# EAGLE design board-v2 (EAGLE 9.1.3)
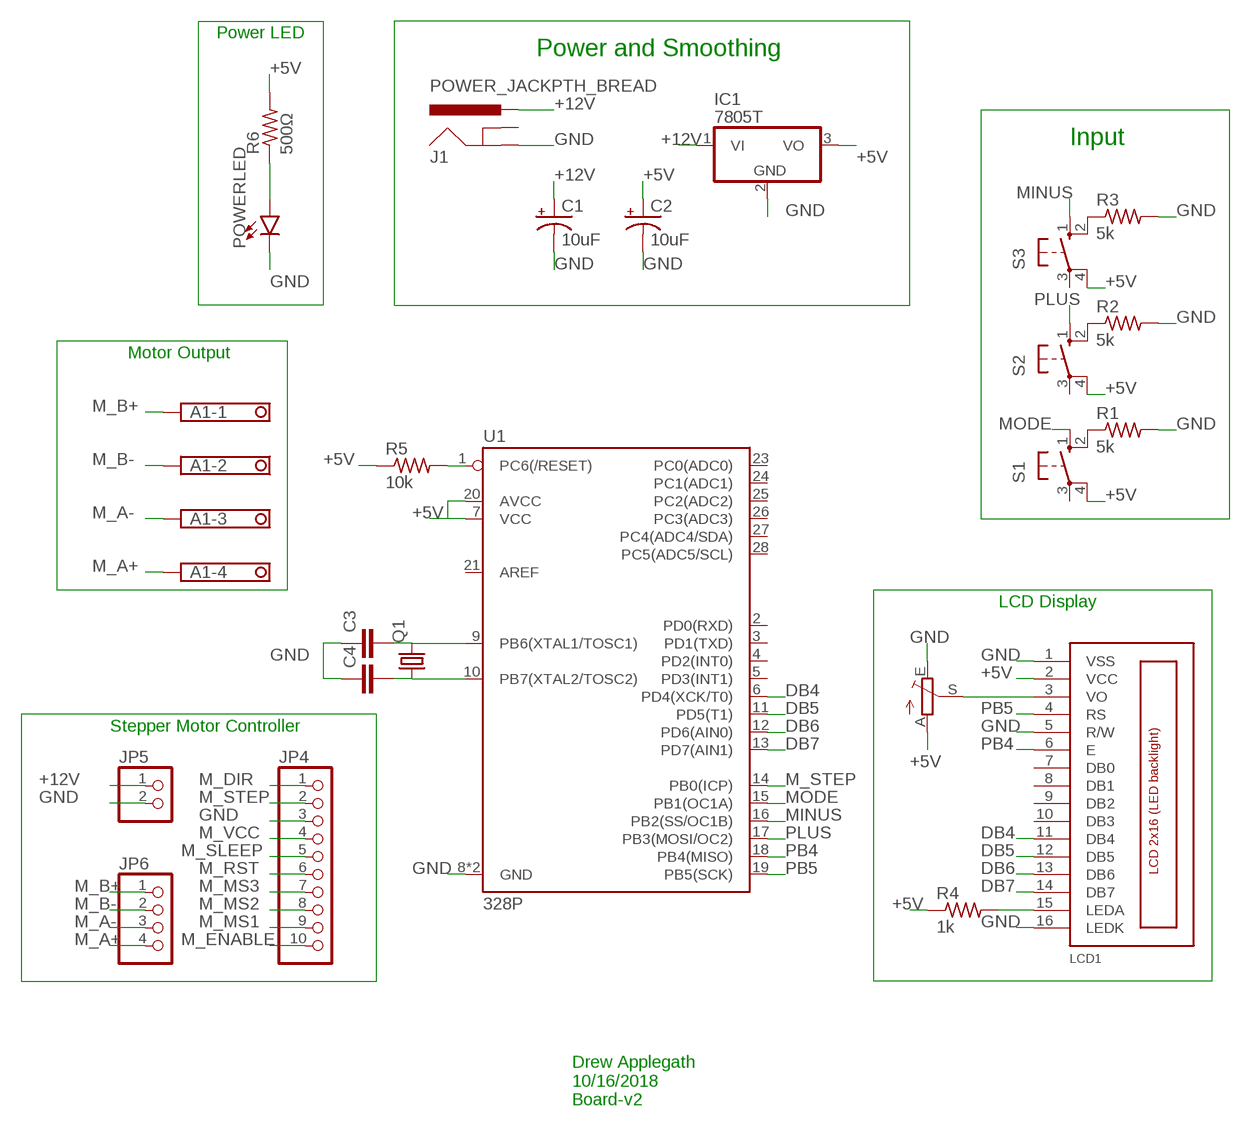
[diagram p0: schematic, sheet 1]

## Parts
A1  TERMINAL-BLOCK-3.5MM-4-PIN-LONG-PAD  [TERMINAL-BLOCK-4-PIN-3.5MM-LONG-PAD]
C1  10uF  10UF-POLAR-RADIAL-2.5MM-25V-20%  [CPOL-RADIAL-2.5MM-5MM]
C2  10uF  10UF-POLAR-RADIAL-2.5MM-25V-20%  [CPOL-RADIAL-2.5MM-5MM]
C3  C-EU025-024X044  [C025-024X044]
C4  C-EU025-024X044  [C025-024X044]
IC1  7805T  [TO220H]
J1  POWER_JACKPTH_BREAD  [POWER_JACK_PTH_BREAD]
JP4  PINHD-1X10  [1X10]
JP5  PINHD-1X2  [1X02]
JP6  PINHD-1X4  [1X04]
LCD1  LCD_2X16_SIL  [HY-1602F]
POWERLED  LED-3MM-NO_SILK  [LED_3MM-NS]
Q1  CRYSTALHC49S  [HC49/S]
R1  5k  R-US_0207/7  [0207/7]
R2  5k  R-US_0207/7  [0207/7]
R3  5k  R-US_0207/7  [0207/7]
R4  1k  R-US_0207/7  [0207/7]
R5  10k  R-US_0207/7  [0207/7]
R6  500Ω  R-US_0207/7  [0207/7]
R7  TRIM_EU-S63S  [S63S]
S1  40-XX  [B3F-40XX]
S2  40-XX  [B3F-40XX]
S3  40-XX  [B3F-40XX]
U1  328P  ATMEGA328P_PDIP  [DIP28]

## Nets
+5V: C2.1(+) IC1.3(VO) LCD1.2(VCC) R4.1 R5.1 R6.2 R7.A S1.4(P1) S2.4(P1) S3.4(P1) U1.7(VCC) U1.20(AVCC)
+12V: C1.1(+) IC1.1(VI) J1.PWR JP5.1
DB4: LCD1.11(DB4) U1.6(PD4(XCK/T0))
DB5: LCD1.12(DB5) U1.11(PD5(T1))
DB6: LCD1.13(DB6) U1.12(PD6(AIN0))
DB7: LCD1.14(DB7) U1.13(PD7(AIN1))
GND: C1.2(-) C2.2(-) C3.1 C4.1 IC1.2(GND) J1.GND JP4.3 JP5.2 LCD1.1(VSS) LCD1.5(R/W) LCD1.16(LEDK) POWERLED.K(C) R1.2 R2.2 R3.2 R7.E U1.8(GND) U1.22(GND)
M_A+: A1.4 JP6.4
M_A-: A1.3 JP6.3
M_B+: A1.1 JP6.1
M_B-: A1.2 JP6.2
M_DIR: JP4.1
M_ENABLE: JP4.10
M_MS1: JP4.9
M_MS2: JP4.8
M_MS3: JP4.7
M_RST: JP4.6
M_SLEEP: JP4.5
M_STEP: JP4.2 U1.14(PB0(ICP))
M_VCC: JP4.4
MINUS: S3.1(S) U1.16(PB2(SS/OC1B))
MODE: S1.1(S) U1.15(PB1(OC1A))
N$1: C4.2 Q1.1 U1.10(PB7(XTAL2/TOSC2))
N$2: LCD1.3(VO) R7.S
N$4: R5.2 U1.1(PC6(/RESET))
N$8: LCD1.15(LEDA) R4.2
N$13: C3.2 Q1.2 U1.9(PB6(XTAL1/TOSC1))
N$14: R1.1 S1.2(S1)
N$15: R2.1 S2.2(S1)
N$16: R3.1 S3.2(S1)
N$18: POWERLED.A R6.1
PB4: LCD1.6(E) U1.18(PB4(MISO))
PB5: LCD1.4(RS) U1.19(PB5(SCK))
PLUS: S2.1(S) U1.17(PB3(MOSI/OC2))
Unconnected: J1.GNDBREAK LCD1.7(DB0) LCD1.8(DB1) LCD1.9(DB2) LCD1.10(DB3) S1.3(P) S2.3(P) S3.3(P) U1.2(PD0(RXD)) U1.3(PD1(TXD)) U1.4(PD2(INT0)) U1.5(PD3(INT1)) U1.21(AREF) U1.23(PC0(ADC0)) U1.24(PC1(ADC1)) U1.25(PC2(ADC2)) U1.26(PC3(ADC3)) U1.27(PC4(ADC4/SDA)) U1.28(PC5(ADC5/SCL))

## Notes on the sheet
- Power LED
- Power and Smoothing
- Input
- Motor Output
- LCD Display
- Stepper Motor Controller
- Drew Applegath
  10/16/2018
  Board-v2

## Library data of the parts
A1 = Rembrandt Electronics - Terminal Block 3-5mm v1-0:TERMINAL-BLOCK-3.5MM-4-PIN: Terminal Block 3.5mm Pitch: 3,5 mm Number of pins: 4 Created by Rembrandt Electronics www.rembrandtelectronics.com
C1 C2 = SparkFun-Capacitors:10UF-POLAR: 10.0µF polarized capacitors A capacitor is a passive two-terminal electrical component used to store electrical energy temporarily in an electric field.; PROD_ID: CAP-08440
C3 C4 = rcl:C-EU: CAPACITOR, European symbol; SPICEPREFIX: C
IC1 = linear:78*: Positive VOLTAGE REGULATOR Source: http://cache.national.com/ds/LM/LM78L05.pdf http://www.fairchildsemi.com/ds/LM/LM7805.pdf
J1 = SparkFun-Connectors:POWER_JACK: Power Jack Connector This is the standard 5.5mm barrel jack for power. The PTH is the most common, proven, reliable, footprint. The Slot footprint only works if the mill layer is transmitted to the PCB fab house so be warned. Here are the connectors we sell at SparkFun: DC Barrel Power Jack/Connector <https://www.sparkfun.com/products/119> (PRT-00119) DC Barrel Power Jack/Connector (SMD) <https://www.sparkfun.com/products/12748> (PRT-12748) DC Barrel Jack Adapter - Breadboard Compatible <https://www.sparkfun.com/products/10811> (PRT-10811) It is used on this SparkFun product (and many, many others): SparkFun RedBoard - Programmed with Arduino <https://www.sparkfun.com/products/12757> (DEV-12757) Also, if you need a mating power supply or connector, please check these out: Wall Adapter Power Supply - 9VDC 650mA <https://www.sparkfun.com/products/298> (TOL-00298) DC Barrel Jack Adapter - Male <https://www.sparkfun.com/products/10287> (PRT-10287); PROD_ID: PRT-10811
JP4 = pinhead:PINHD-1X10: PIN HEADER
JP5 = pinhead:PINHD-1X2: PIN HEADER
JP6 = pinhead:PINHD-1X4: PIN HEADER
LCD1 = lcd_2x16_led_backlight:LCD_2X16_SIL
POWERLED = SparkFun-LED:LED: LED (Generic) Standard schematic elements and footprints for 5mm, 3mm, 1206, and 0603 sized LEDs. Generic LEDs with no color specified.
Q1 = crystal:CRYSTAL: CRYSTAL; OC_FARNELL: 1667008; OC_NEWARK: unknown
R1-R6 = resistor:R-US_: RESISTOR, American symbol
R7 = pot:TRIM_EU-: POTENTIOMETER
S1-S3 = switch-omron:40-XX: OMRON SWITCH; MF: OMRON COMPONENTS USA; MPN: B3F-4000; OC_FARNELL: 176434; OC_NEWARK: 36K3105
U1 = SparkFun-IC-Microcontroller:ATMEGA328P_PDIP: Atmel 328P Through hole ATMEGA328P uC used in the Arduino 32kb flash, 1k EEPROM, 2k SRAM Datasheet <http://www.sparkfun.com/datasheets/Components/SMD/ATMega328.pdf> SparkFun Products Storefront component: AVR 28 Pin 20MHz 32K 6A/D - ATMega328P <https://www.sparkfun.com/products/9061> (COM-09061) SparkFun Simon Says - Through-Hole Soldering Kit <https://www.sparkfun.com/products/10547> (KIT-10547) SparkFun Learn to Solder - Simon Says <https://www.sparkfun.com/products/13708> (KIT-13708) SparkFun BigTime Watch Kit <https://www.sparkfun.com/products/11734> (KIT-11734) SparkFun ClockIt <https://www.sparkfun.com/products/10930> (KIT-10930) SparkFun Serial Enabled LCD Kit <https://www.sparkfun.com/products/10097> (LCD-10097) SparkFun Simon Tilts - Through Hole Soldering Kit <https://www.sparkfun.com/products/12634> (KIT-12634) SparkFun Frequency Counter Kit <https://www.sparkfun.com/products/10140> (KIT-10140) FabFM Radio Kit <https://www.sparkfun.com/products/11043> (KIT-11043) SparkFun Binary Blaster Kit <https://www.sparkfun.com/products/12037> (KIT-12037) SparkFun Metro-Gnome <https://www.sparkfun.com/products/9236> (KIT-09236) ATmega328 with Arduino Optiboot (Uno) <https://www.sparkfun.com/products/10524> (DEV-10524); PROD_ID: IC-09136

## Board
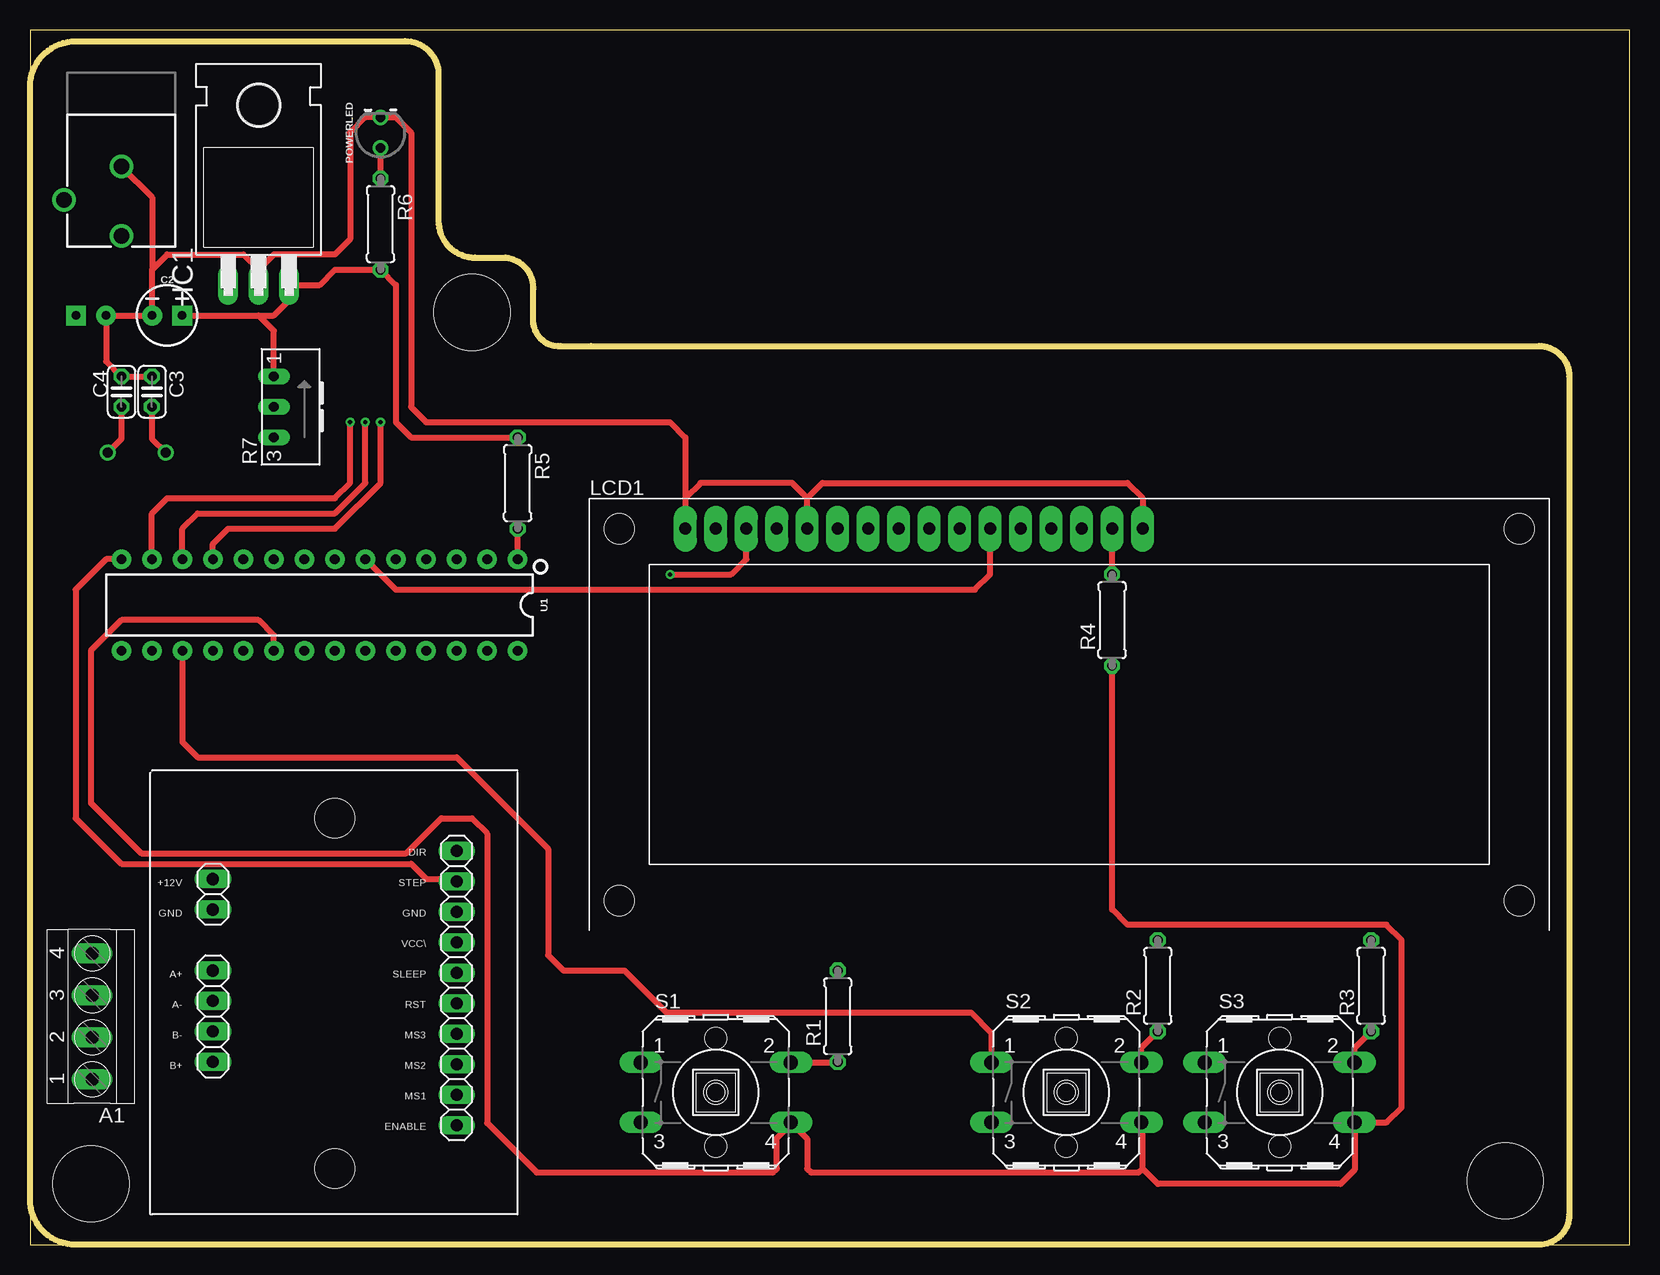
[diagram p1: board, top side]
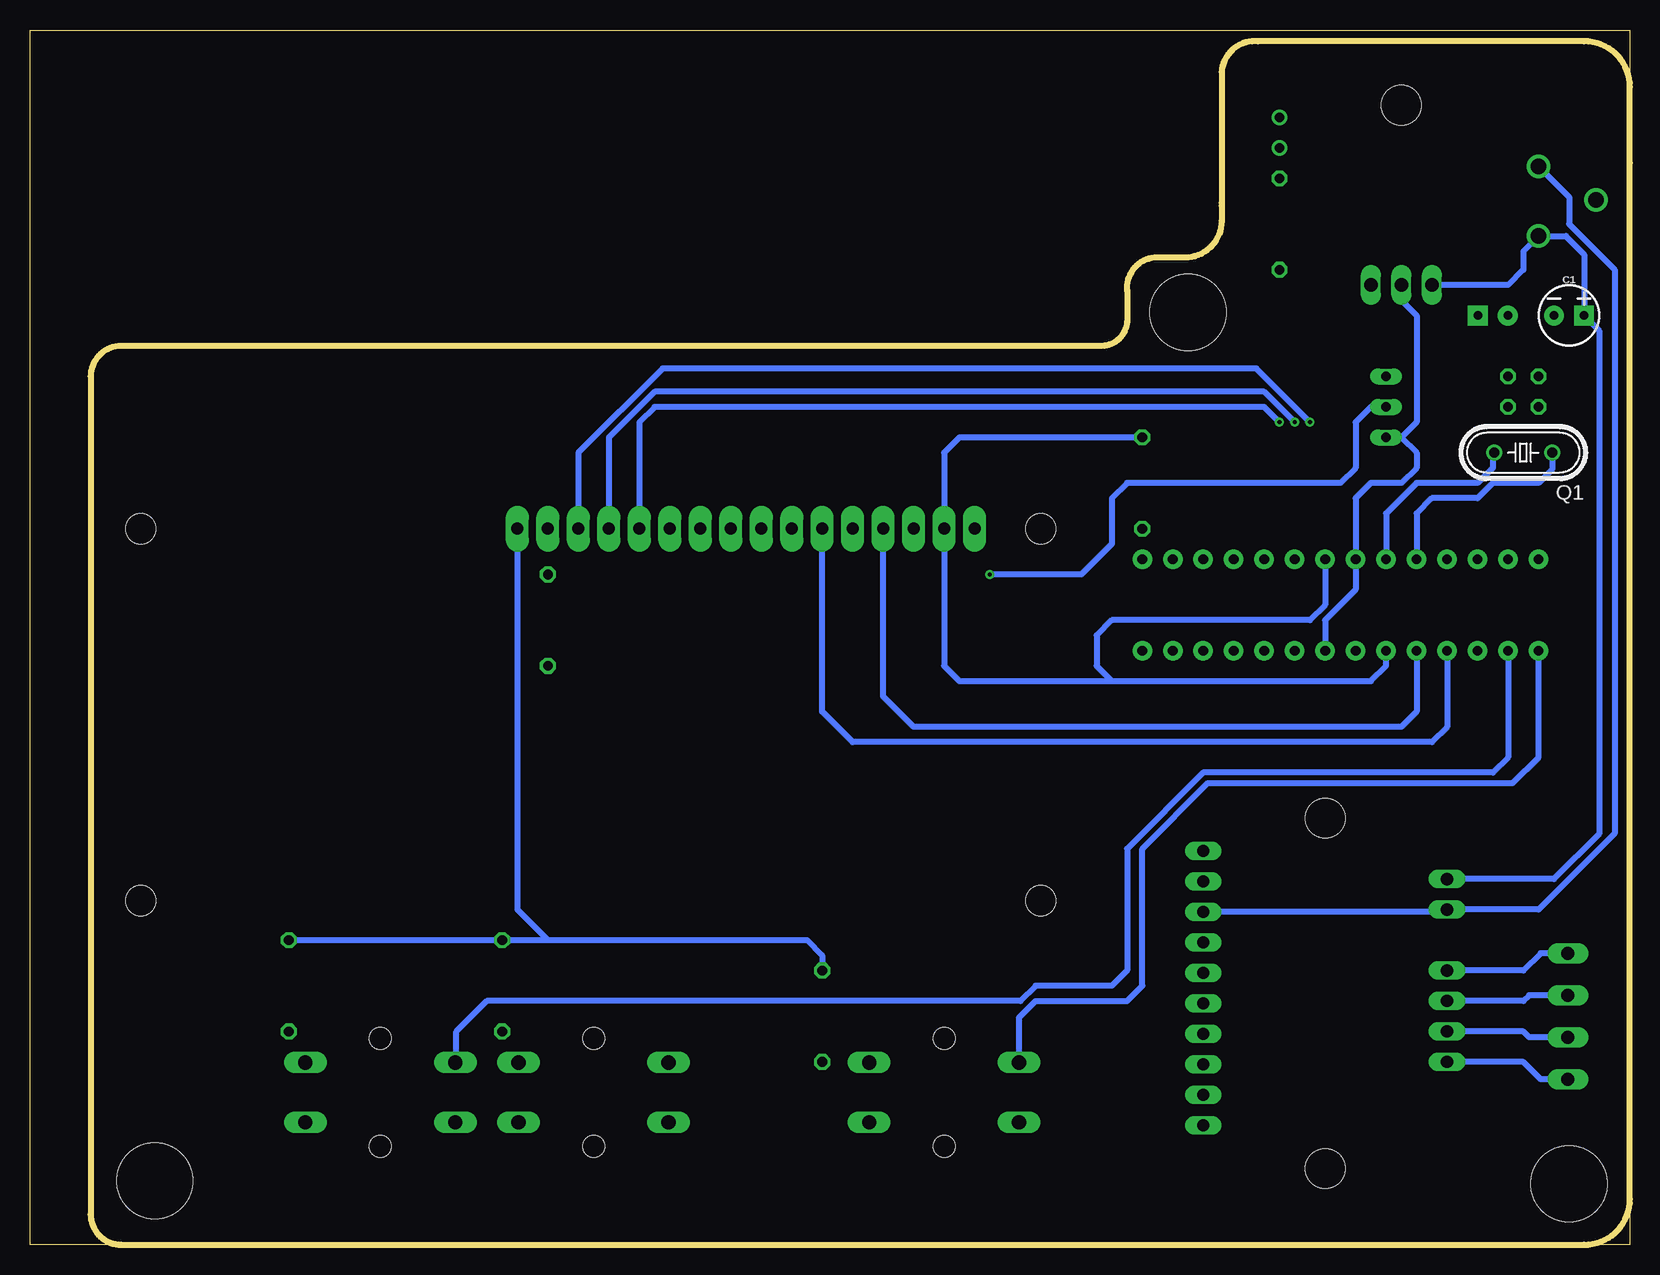
[diagram p2: board, bottom side, seen from below]

Size 133.33 x 101.27 mm. Coordinates in mm from the lower left corner, seen from the top.
Outline: 0,0 133.33,0 133.33,101.27 0,101.27 0,95.25 0,0
Copper layers (1*16): Top 0.035mm / dielectric 1.5mm / Bottom 0.035mm
Design rules "default *": minimum track width 10mil, minimum drill 0.35mm, track to track 10mil, track to pad 10mil, pad to pad 10mil, via to via 10mil, smd to smd 10mil, copper to edge 40mil, drill to drill 6mil, minimum pad ring 10mil, minimum via ring 8mil, stop-mask expansion 4mil, vias tented up to drill 0mil, thermal gap 10mil
Holes 3.3 mm at 25.4,6.35 25.4,35.56
Holes 6.35 mm at 5.08,5.08 122.94,5.33 36.83,77.72
Milling: 19 lines

### Footprints (pad centres in the part's own frame; a part is rotated, then mirrored left to right if it is on the bottom)
TERMINAL-BLOCK-4-PIN-3.5MM-LONG-PAD = drill 1.1 pad 1.7 long: 1 -5.25,-0.1; 2 -1.75,-0.1; 3 1.75,-0.1; 4 5.25,-0.1
CPOL-RADIAL-2.5MM-5MM = drill 0.7 pad 1.651 square: 1 1.25,0 | drill 0.7 pad 1.651: 2 -1.25,0
C025-024X044 = drill 0.813 octagon: 1 -1.27,0; 2 1.27,0
TO220H = drill 1.118 long: 1 -2.54,-10.16; 2 0,-10.16; 3 2.54,-10.16 | hole 3.302: 0,4.826
POWER_JACK_PTH_BREAD = drill 1.3: GND 0,7.9; GNDBREAK 4.8,10.7; PWR 0,13.7
1X10 = drill 1.016 long: 1 -11.43,0; 2 -8.89,0; 3 -6.35,0; 4 -3.81,0; 5 -1.27,0; 6 1.27,0; 7 3.81,0; 8 6.35,0; 9 8.89,0; 10 11.43,0
1X02 = drill 1.016 long: 1 -1.27,0; 2 1.27,0
1X04 = drill 1.016 long: 1 -3.81,0; 2 -1.27,0; 3 1.27,0; 4 3.81,0
HY-1602F = drill 1 pad 1.93 long: 1 2.54,0; 2 5.08,0; 3 7.62,0; 4 10.16,0; 5 12.7,0; 6 15.24,0; 7 17.78,0; 8 20.32,0; 9 22.86,0; 10 25.4,0; 11 27.94,0; 12 30.48,0; 13 33.02,0; 14 35.56,0; 15 38.1,0; 16 40.64,0 | hole 2.5: -2.96,0; 72.04,0; -2.96,-31; 72.04,-31
LED_3MM-NS = drill 0.813: A -1.27,0; K 1.27,0
HC49/S = drill 0.813: 1 -2.413,0; 2 2.413,0
0207/7 = drill 0.813 octagon: 1 -3.81,0; 2 3.81,0
S63S = drill 0.813 long: A 2.54,1.27; E -2.54,1.27; S 0,1.27
B3F-40XX = drill 1.194 long: 1 -6.248,2.489; 2 6.248,2.489; 3 -6.248,-2.489; 4 6.248,-2.489 | hole 1.803: 0,-4.496; 0,4.496
DIP28 = drill 0.813 pad 1.626: 1 -16.51,-3.81; 2 -13.97,-3.81; 3 -11.43,-3.81; 4 -8.89,-3.81; 5 -6.35,-3.81; 6 -3.81,-3.81; 7 -1.27,-3.81; 8 1.27,-3.81; 9 3.81,-3.81; 10 6.35,-3.81; 11 8.89,-3.81; 12 11.43,-3.81; 13 13.97,-3.81; 14 16.51,-3.81; 15 16.51,3.81; 16 13.97,3.81; 17 11.43,3.81; 18 8.89,3.81; 19 6.35,3.81; 20 3.81,3.81; 21 1.27,3.81; 22 -1.27,3.81; 23 -3.81,3.81; 24 -6.35,3.81; 25 -8.89,3.81; 26 -11.43,3.81; 27 -13.97,3.81; 28 -16.51,3.81

### Placement (x,y rotation side)
A1  5.08,19.05 90 top
C1  5.08,77.47 0 bottom
C2  11.43,77.47 0 top
C3  10.16,71.12 270 top
C4  7.62,71.12 270 top
IC1  19.05,90.17 0 top
J1  7.62,97.79 180 top
JP4  35.56,21.4 270 top
JP5  15.24,29.21 270 top
JP6  15.24,19.05 90 top
LCD1  52.07,59.69 0 top
POWERLED  29.21,92.71 90 top
Q1  8.89,66.04 180 bottom
R1  67.31,19.05 90 top
R2  93.98,21.59 90 top
R3  111.76,21.59 90 top
R4  90.17,52.07 90 top
R5  40.64,63.5 270 top
R6  29.21,85.09 270 top
R7  21.59,69.85 90 top
S1  57.15,12.7 0 top
S2  86.36,12.7 0 top
S3  104.14,12.7 0 top
U1  24.13,53.34 180 top

### Tracks (layer width: path | path; a pad name or v marks a point on that pad's centre or on a via)
+5V
  Top 0.508: S1.4 63.48,10.13 | 63.48,10.13 64.77,8.84 64.77,6.35 65.09,6.03 92.39,6.03 92.71,6.35 | S2.4 92.71,10.11 92.71,7.62 92.71,6.35 | 92.71,6.35 93.98,5.08 109.22,5.08 110.39,6.25 S3.4 113.08,10.21 114.3,11.43 114.3,25.4 113.03,26.67 91.44,26.67 90.17,27.94 R4.1 | C2.1 19.05,77.47 | 19.05,77.47 20.32,77.47 21.59,78.74 IC1.3 24.13,80.01 25.4,81.28 R6.2 30.48,80.01 30.48,68.58 31.75,67.31 R5.1 | R7.A 20.32,76.2 19.05,77.47 | U1.20 20.32,50.8 19.05,52.07 7.62,52.07 5.08,49.53 5.08,36.83 9.27,32.64 31.37,32.64 34.29,35.56 36.83,35.56 38.1,34.29 38.1,10.16 42.23,6.03 61.91,6.03 62.23,6.35 62.23,8.89 63.48,10.13
  Bottom 0.508: R5.1 55.88,67.31 57.15,66.04 LCD1.2 57.15,48.26 55.88,46.99 43.18,46.99 | 43.18,46.99 44.45,48.26 44.45,50.8 43.18,52.07 26.67,52.07 25.4,53.34 U1.7 | 43.18,46.99 21.59,46.99 20.32,48.26 U1.20
+12V
  Bottom 0.508: IC1.1 10.16,80.01 8.89,81.28 8.89,82.82 J1.PWR 5.35,84.09 3.81,82.55 3.81,77.49 C1.1 2.56,76.2 2.56,34.27 6.35,30.48 JP5.1
DB4
  Top 0.508: U1.6 30.48,54.61 46.99,54.61 78.74,54.61 80.01,55.88 LCD1.11
DB5  (via drill 0.35)
  Top 0.508: U1.11 15.24,58.42 16.51,59.69 25.4,59.69 29.21,63.5 v29.21,68.58
  Bottom 0.508: LCD1.12 82.55,68.58 81.28,69.85 30.48,69.85 v29.21,68.58
DB6  (via drill 0.35)
  Top 0.508: U1.12 12.7,59.69 13.97,60.96 25.4,60.96 27.94,63.5 v27.94,68.58
  Bottom 0.508: LCD1.13 85.09,67.31 81.28,71.12 30.48,71.12 v27.94,68.58
DB7  (via drill 0.35)
  Top 0.508: U1.13 10.16,60.96 11.43,62.23 25.4,62.23 26.67,63.5 v26.67,68.58
  Bottom 0.508: LCD1.14 87.63,66.04 80.62,73.05 31.14,73.05 v26.67,68.58
GND
  Top 0.508: C3.1 C4.1 6.35,73.66 6.35,77.45 C1.2 C2.2 10.18,81.3 | 10.18,81.3 11.43,82.55 17.78,82.55 19.05,81.28 | 19.05,81.28 IC1.2 | 19.05,81.28 20.32,82.55 25.4,82.55 26.67,83.82 26.67,92.71 27.94,93.98 POWERLED.K 30.48,93.98 31.75,92.71 31.75,69.85 33.02,68.58 53.34,68.58 54.61,67.31 54.61,62.23 | LCD1.5 64.77,62.23 | 64.77,62.23 66.04,63.5 91.44,63.5 92.71,62.23 LCD1.16 | 64.77,62.23 63.5,63.5 55.88,63.5 54.61,62.23 | 54.61,62.23 LCD1.1 | J1.GND 10.18,87.33 10.18,81.3
  Bottom 0.508: U1.22 25.4,52.07 22.86,54.61 U1.8 22.86,62.23 21.59,63.5 19.05,63.5 17.78,64.77 17.78,66.04 19.05,67.31 | J1.GND 5.08,87.35 5.08,85.09 1.27,81.28 1.27,34.29 7.62,27.94 JP5.2 15.43,27.75 JP4.3 | R3.2 R2.2 91.44,25.4 90.17,25.4 | IC1.2 19.05,78.74 17.78,77.47 17.78,68.58 19.05,67.31 | R7.E 19.05,67.31 | LCD1.16 92.71,46.99 92.71,27.94 90.17,25.4 | R1.2 67.31,24.13 68.58,25.4 90.17,25.4
M_A+
  Bottom 0.508: A1.4 7.45,24.3 8.89,22.86 JP6.4
M_A-
  Bottom 0.508: A1.3 8.41,20.8 8.89,20.32 JP6.3
M_B+
  Bottom 0.508: A1.1 7.45,13.8 8.89,15.24 JP6.1
M_B-
  Bottom 0.508: A1.2 8.41,17.3 8.89,17.78 JP6.2
M_STEP
  Top 0.508: U1.14 6.35,57.15 3.81,54.61 3.81,35.56 7.62,31.75 31.75,31.75 33.02,30.48 35.37,30.48 JP4.2
MINUS
  Bottom 0.508: U1.16 10.16,40.64 11.43,39.37 35.56,39.37 41.91,33.02 41.91,22.86 43.18,21.59 49.53,21.59 50.8,20.32 95.25,20.32 97.79,17.78 97.79,15.29 S3.1
MODE
  Bottom 0.508: S1.1 50.9,18.95 49.53,20.32 41.91,20.32 40.64,21.59 40.64,33.02 35.18,38.48 9.78,38.48 7.62,40.64 U1.15
N$1
  Top 0.508: C4.2 7.62,67.18 Q1.1
  Bottom 0.508: Q1.1 6.48,64.64 7.62,63.5 11.43,63.5 12.7,62.23 16.51,62.23 17.78,60.96 U1.10
N$2  (via drill 0.35)
  Top 0.508: v53.34,55.88 58.42,55.88 59.69,57.15 LCD1.3
  Bottom 0.508: R7.S 21.59,69.85 22.86,68.58 22.86,64.77 24.13,63.5 41.91,63.5 43.18,62.23 43.18,58.42 45.72,55.88 v53.34,55.88
N$4
  Top 0.508: U1.1 R5.2
N$8
  Top 0.508: R4.2 LCD1.15
N$13
  Top 0.508: C3.2 10.16,67.18 Q1.2
  Bottom 0.508: Q1.2 11.43,65.91 11.43,64.77 12.7,63.5 17.78,63.5 20.32,60.96 U1.9
N$14
  Top 0.508: S1.2 67.26,15.19 R1.1
N$15
  Top 0.508: R2.1 92.61,16.41 S2.2
N$16
  Top 0.508: R3.1 110.39,16.41 S3.2
N$18
  Top 0.508: R6.1 POWERLED.A
PB4
  Bottom 0.508: U1.18 15.24,43.18 16.51,41.91 64.77,41.91 67.31,44.45 LCD1.6
PB5
  Bottom 0.508: U1.19 17.78,44.45 19.05,43.18 59.69,43.18 62.23,45.72 LCD1.4
PLUS
  Top 0.508: U1.17 12.7,41.91 13.97,40.64 35.56,40.64 43.18,33.02 43.18,24.13 44.45,22.86 49.53,22.86 53.02,19.37 78.42,19.37 80.11,17.68 S2.1

### Text on the board
tNames: DIR | +12V | STEP | GND | GND | VCC\ | A+ | SLEEP | A- | RST | B- | MS3 | B+ | MS2 | MS1 | ENABLE